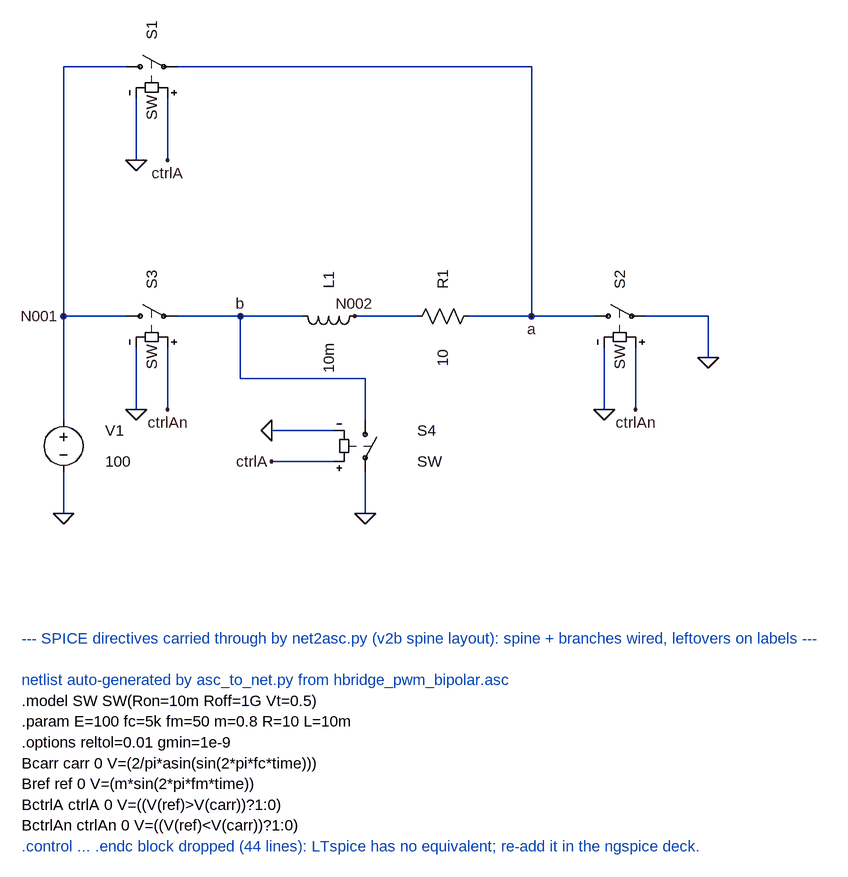
[diagram p0: schematic hbridge_pwm_bipolar.asc]
hbridge_pwm_bipolar.asc, the LTspice schematic file:
Version 4
SHEET 1 2080 1520
WIRE 128 512 224 512
WIRE 288 560 288 656
WIRE 240 560 240 656
WIRE 304 512 400 512
WIRE 400 512 496 512
WIRE 576 512 672 512
WIRE 752 512 848 512
WIRE 848 512 944 512
WIRE 1008 560 1008 656
WIRE 960 560 960 656
WIRE 1024 512 1120 512
WIRE 1120 512 1120 576
WIRE 128 512 128 128
WIRE 128 128 224 128
WIRE 288 176 288 272
WIRE 240 176 240 272
WIRE 304 128 848 128
WIRE 848 128 848 512
WIRE 128 512 128 608
WIRE 128 608 128 672
WIRE 128 752 128 816
WIRE 400 512 400 608
WIRE 400 608 592 608
WIRE 592 608 592 672
WIRE 544 736 448 736
WIRE 544 688 448 688
WIRE 592 752 592 816
FLAG 128 512 N001
FLAG 288 656 ctrlAn
FLAG 240 656 0
FLAG 400 512 b
FLAG 848 512 a
FLAG 1008 656 ctrlAn
FLAG 960 656 0
FLAG 1120 576 0
FLAG 288 272 ctrlA
FLAG 240 272 0
FLAG 128 816 0
FLAG 448 736 ctrlA
FLAG 448 688 0
FLAG 592 816 0
FLAG 576 512 N002
SYMBOL sw 208 512 R270
WINDOW 0 56 56 Center 2
WINDOW 3 -64 56 Center 2
SYMATTR InstName S3
SYMATTR Value SW
SYMBOL ind 592 496 R90
WINDOW 0 -40 56 Center 2
WINDOW 3 80 56 Center 2
SYMATTR InstName L1
SYMATTR Value 10m
SYMBOL res 768 496 R90
WINDOW 0 -40 56 Center 2
WINDOW 3 80 56 Center 2
SYMATTR InstName R1
SYMATTR Value 10
SYMBOL sw 928 512 R270
WINDOW 0 56 56 Center 2
WINDOW 3 -64 56 Center 2
SYMATTR InstName S2
SYMATTR Value SW
SYMBOL sw 208 128 R270
WINDOW 0 56 56 Center 2
WINDOW 3 -64 56 Center 2
SYMATTR InstName S1
SYMATTR Value SW
SYMBOL voltage 128 656 R0
WINDOW 0 64 32 Left 2
WINDOW 3 64 80 Left 2
SYMATTR InstName V1
SYMATTR Value 100
SYMBOL sw 592 656 R0
WINDOW 0 80 32 Left 2
WINDOW 3 80 80 Left 2
SYMATTR InstName S4
SYMATTR Value SW
TEXT 64 1008 Left 2 ;--- SPICE directives carried through by net2asc.py (v2b spine layout): spine + branches wired, leftovers on labels ---
TEXT 64 1072 Left 2 ;netlist auto-generated by asc_to_net.py from hbridge_pwm_bipolar.asc
TEXT 64 1104 Left 2 !.model SW SW(Ron=10m Roff=1G Vt=0.5)
TEXT 64 1136 Left 2 !.param E=100 fc=5k fm=50 m=0.8 R=10 L=10m
TEXT 64 1168 Left 2 !.options reltol=0.01 gmin=1e-9
TEXT 64 1200 Left 2 !Bcarr carr 0 V=(2/pi*asin(sin(2*pi*fc*time)))
TEXT 64 1232 Left 2 !Bref ref 0 V=(m*sin(2*pi*fm*time))
TEXT 64 1264 Left 2 !BctrlA ctrlA 0 V=((V(ref)>V(carr))?1:0)
TEXT 64 1296 Left 2 !BctrlAn ctrlAn 0 V=((V(ref)<V(carr))?1:0)
TEXT 64 1328 Left 2 ;.control ... .endc block dropped (44 lines): LTspice has no equivalent; re-add it in the ngspice deck.

The netlist it stands for:
* hbridge_pwm_bipolar.asc
S3 N001 b ctrlAn 0 SW
L1 N002 b 10m
R1 a N002 10
S2 a 0 ctrlAn 0 SW
S1 N001 a ctrlA 0 SW
V1 N001 0 100
S4 b 0 ctrlA 0 SW
* --- SPICE directives carried through by net2asc.py (v2b spine layout): spine + branches wired, leftovers on labels ---
* netlist auto-generated by asc_to_net.py from hbridge_pwm_bipolar.asc
.model SW SW(Ron=10m Roff=1G Vt=0.5)
.param E=100 fc=5k fm=50 m=0.8 R=10 L=10m
.options reltol=0.01 gmin=1e-9
Bcarr carr 0 V=(2/pi*asin(sin(2*pi*fc*time)))
Bref ref 0 V=(m*sin(2*pi*fm*time))
BctrlA ctrlA 0 V=((V(ref)>V(carr))?1:0)
BctrlAn ctrlAn 0 V=((V(ref)<V(carr))?1:0)
* .control ... .endc block dropped (44 lines): LTspice has no equivalent; re-add it in the ngspice deck.
.backanno
.end